# Altium schematic sheet Schematic.SchDoc
size A4; SheetNumber: 1; SheetTotal: 1
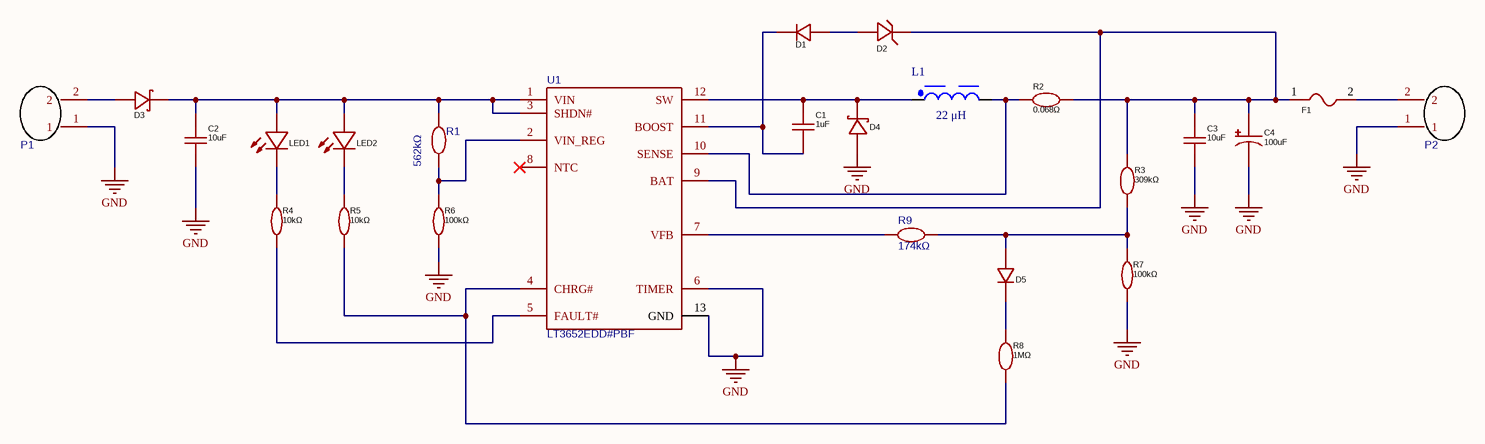
[diagram p0: Schematic.SchDoc]

## Parts
C1  1uF  [C0805]
C2  10uF  [C1206]
C3  10uF  [C1206]
C4  100uF  [CAP-SMD_BD8.0-L8.3-W8.3-LS9.5-FD]
D1  1N4148WS-7-F  [SOD-323_L1.8-W1.3-LS2.5-RD]  (value not drawn)
D2  MMSZ5234BT1G  [SOD-123_L2.8-W1.8-LS3.7-RD]  (value not drawn)
D3  V8PAL45-M3/I  [DO-221BC_L4.3-W2.7-LS5.3-RD]  (value not drawn)
D4  V8PAL45-M3/I  [DO-221BC_L4.3-W2.7-LS5.3-RD]  (value not drawn)
D5  1N4148WS-7-F  [SOD-323_L1.8-W1.3-LS2.5-RD]  (value not drawn)
F1  0437003.WR  [F1206]  (value not drawn)
L1  22 μH  [WE-PD_7345R]
LED1  LTST-C170KRKT  [LED0805-R-RD]  (value not drawn)
LED2  LTST-C170KRKT  [LED0805-R-RD]  (value not drawn)
P1  WJ128V-5.0-2P  [CONN-TH_2P-P5.00_WJ128V-5.0-2P]  (value not drawn)
P2  WJ128V-5.0-2P  [CONN-TH_2P-P5.00_WJ128V-5.0-2P]  (value not drawn)
R1  562kΩ  [R0805]
R2  0.068Ω  [R0805]
R3  309kΩ  [R0805]
R4  10kΩ  [R0805]
R5  10kΩ  [R0805]
R6  100kΩ  [R0805]
R7  100kΩ  [R0805]
R8  1MΩ  [R0805]
R9  174kΩ  [R0805]
U1  LT3652EDD#PBF  [DFN-12_L3.0-W3.0-P0.50-LS3.0-BL-EP]

## Nets
GND: C2.2 C3.1 C4.2 D4.2(K) P1.1 P2.1 R6.1 R7.1 U1.6(TIMER) U1.13(GND)
NetC1_1: C1.1 D1.1(C) U1.11(BOOST)
NetC1_2: C1.2 D4.1(A) L1.1 U1.12(SW)
NetC2_1: C2.1 D3.1(A) LED1.1(+) LED2.1(+) R1.2 U1.1(VIN) U1.3(SHDN#)
NetC3_2: C3.2 C4.1 D2.1(C) F1.1 R2.2 R3.2 U1.9(BAT)
NetD1_2: D1.2(A) D2.2(A)
NetD3_2: D3.2(K) P1.2
NetD5_1: D5.1(C) R8.2
NetD5_2: D5.2(A) R3.1 R7.2 R9.2
NetF1_2: F1.2 P2.2
NetL1_2: L1.2 R2.1 U1.10(SENSE)
NetLED1_2: LED1.2(-) R4.2
NetLED2_2: LED2.2(-) R5.2
NetR1_1: R1.1 R6.2 U1.2(VIN_REG)
NetR4_1: R4.1 U1.5(FAULT#)
NetR5_1: R5.1 R8.1 U1.4(CHRG#)
NetR9_1: R9.1 U1.7(VFB)

Not connected (* = marked no-connect by the designer): U1 8(NTC)*

## Notes on the sheet
- Date:
- Rev. No.
- Page No.
- Schematic Name
- Designed By
- Omar Faruk Badhon
- Check(1) HW Eng.
- Check(2) SW Eng.
- Approval(1)
- Approval(2)
- Address
- Company
- Dept. Name
- R&D

## Library data of the parts
C1 = GRM216R61E105KA12D: 25V 1uF X5R ±10% 0805 Multilayer Ceramic Capacitors MLCC - SMD/SMT ROHS; Manufacturer: muRata(村田); Add into BOM: yes; Symbol: GRM216R61E105KA12D; Device: GRM216R61E105KA12D; LCSC Part Name: 1uF ±10% 25V; Supplier Part: C440193; Manufacturer Part: GRM216R61E105KA12D; Supplier Footprint: 0805; JLCPCB Part Class: Extended Part; Datasheet: https://atta.szlcsc.com/upload/public/pdf/source/20191022/C440211_D691AF4420B7318595498C3E4B7F2331.pdf; Supplier: LCSC; Convert to PCB: yes; Value: 1uF; Tolerance: ±10%
C2 C3 = GRT31CR6YA106KE01L: 35V 10uF X5R ±10% 1206 Multilayer Ceramic Capacitors MLCC - SMD/SMT ROHS; Manufacturer: Murata Electronics; Add into BOM: yes; Symbol: GRT31CR6YA106KE01L; Device: GRT31CR6YA106KE01L; LCSC Part Name: 10uF ±10% 35V; Supplier Part: C2175512; Manufacturer Part: GRT31CR6YA106KE01L; Supplier Footprint: 1206; JLCPCB Part Class: Extended Part; Supplier: LCSC; Convert to PCB: yes; Value: 10uF; Tolerance: ±10%
C4 = EEEHC1E101P: 100uF 25V 130mA@120Hz ±20% SMD,D8xL10.2mm Aluminum Electrolytic Capacitors - SMD ROHS; Manufacturer: PANASONIC(松下); Add into BOM: yes; Lifetime @ Temp: 5000hrs@105℃; Symbol: EEEHC1E101P; Device: EEEHC1E101P; LCSC Part Name: 100uF ±20% 25V; Supplier Part: C336335; Manufacturer Part: EEEHC1E101P; Supplier Footprint: SMD,D8xL10.2mm; JLCPCB Part Class: Extended Part; Datasheet: https://atta.szlcsc.com/upload/public/pdf/source/20190305/C336336_78C21C8ECF10E68AF1E1A1FAA303815A.pdf; Supplier: LCSC; Convert to PCB: yes; Value: 100uF; Tolerance: ±20%; Ripple Current: 130mA@120Hz; Equivalent Series Resistance(ESR): -; Operating Temperature: -40℃~+105℃
D1 D5 = 1N4148WS-7-F: 75V Independent Type 1.25V@150mA 4ns 150mA SOD-323 Switching Diodes ROHS; Manufacturer: DIODES(美台); Add into BOM: yes; Reverse Leakage Current: 1uA@75V; Symbol: 1N4148WS-7-F; Device: 1N4148WS-7-F; LCSC Part Name: 电压:75V 电流:150mA; Supplier Part: C60580; Manufacturer Part: 1N4148WS-7-F; Supplier Footprint: SOD-323; JLCPCB Part Class: Extended Part; Datasheet: https://atta.szlcsc.com/upload/public/pdf/source/20160107/1457707747110.pdf; Supplier: LCSC; Convert to PCB: yes; Diode Configuration: Independent Type; Forward Voltage (Vf@If): 1.25V@150mA; Operating Temperature: -65℃~+150℃@(Tj)
D2 = MMSZ5234BT1G: Independent Type 5.89V~6.51V 500mW 6.2V SOD-123 Zener Diodes ROHS; Manufacturer: onsemi(安森美); Add into BOM: yes; Reverse Leakage Current (Ir): 5uA@4V; Impedance(Zzt): 7Ω; Symbol: MMSZ5234BT1G; Device: MMSZ5234BT1G; LCSC Part Name: MMSZ5234BT1G; Supplier Part: C194181; Manufacturer Part: MMSZ5234BT1G; Supplier Footprint: SOD-123; JLCPCB Part Class: Extended Part; Datasheet: https://atta.szlcsc.com/upload/public/pdf/source/20221020/24E30AC3B161AD81AE78606E4A7F6AC2.pdf; Supplier: LCSC; Convert to PCB: yes; Diode Configuration: Independent Type; Zener Voltage(Nom): 6.2V; Zener Voltage(Range): 5.89V~6.51V; Pd - Power Dissipation(Pd): 500mW
D3 D4 = V8PAL45-M3/I: 45V 4A 570mV@8A DO-221BC(SMPA) Schottky Diodes ROHS; Manufacturer: VISHAY(威世); Add into BOM: yes; Reverse Leakage Current (Ir): 1.85mA@45V; Symbol: V8PAL45-M3/I; Device: V8PAL45-M3/I; LCSC Part Name: 电压:45V 电流:4A; Supplier Part: C3759194; Manufacturer Part: V8PAL45-M3/I; Supplier Footprint: DO-221BC(SMPA); JLCPCB Part Class: Extended Part; Datasheet: https://atta.szlcsc.com/upload/public/pdf/source/20231212/E8913B3A928D0C347C4F04EA6F9113F3.pdf; Supplier: LCSC; Convert to PCB: yes; Forward Voltage (Vf@If): 570mV@8A; Reverse Voltage (Vr): 45V; Rectified Current: 4A
F1 = Fuse: 50A SMD Fuse 3A 32V 1206 Disposable fuses ROHS; Manufacturer: Littelfuse(美国力特); Add into BOM: yes; Voltage Rating (DC): 35V; Symbol: 0437003.WR; Device: 0437003.WR; LCSC Part Name: 32V贴片式保险丝; Supplier Part: C99539; Manufacturer Part: 0437003.WR; Supplier Footprint: 1206; JLCPCB Part Class: Extended Part; Datasheet: https://atta.szlcsc.com/upload/public/pdf/source/20170322/1490151740362.pdf; Supplier: LCSC; Convert to PCB: yes; Type: SMD Fuse; Current Rating: 3A; Voltage Rating  (AC): 32V; Operating Temperature: -55℃~+150℃; Breaking Capacity: 50A
L1 = 7447779122: WE-PD SMT Power Inductor, size 7345R, 22 μH, 1.41 A, 110 mΩ; Manufacturer: Wurth Elektronik; DC Resistance: 90 mΩ; DC Resistance Max: 110 mΩ; Rated Current: 1.41 A; Saturation Current: 1.7 A; Self Resonant Frequency: 17 MHz; Type: Robust; Manufacturer Part Number: 7447779122; Category: Power Inductors; Match Code: WE-PD; ComponentLink1Description: Website Link; ComponentLink1URL: https://www.we-online.com/redexpert/article/7447779122?ad; ComponentLink2Description: Datasheet Link; ComponentLink2URL: https://www.we-online.com/redexpert/spec/7447779122?ad; Mount: Surface Mount; Min Operating Temperature: -40 °C; Max Operating Temperature: 125 °C; Packaging: Tape and Reel; Case/Size Code: 7345R; Length: 7.3 mm; Width: 7.3 mm; Height: 4.5 mm; Inductance: 22 μH
LED1 LED2 = LTST-C170KRKT: 20mA 54mcd Colorless Transparent Lens -55℃~+85℃ 631nm Red 130° 75mW 2V 0805 LED Indication - Discrete ROHS; Manufacturer: LITEON(光宝); Add into BOM: yes; Peak Wavelength: 639nm; Symbol: LTST-C170KRKT; Device: LTST-C170KRKT; LCSC Part Name: LTST-C170KRKT; Supplier Part: C94868; Manufacturer Part: LTST-C170KRKT; Supplier Footprint: 0805; JLCPCB Part Class: Extended Part; Datasheet: https://atta.szlcsc.com/upload/public/pdf/source/20170325/1490427902593.pdf; Supplier: LCSC; Convert to PCB: yes; Emitted Color: Red; Forward Voltage (VF): 2V; Power Dissipation: 75mW; Forward Current: 20mA; Dominant Wavelength: 631nm; Diode Configuration: -; Lens Color: Colorless Transparent Lens; Color Temperature: -; Luminous Intensity: 54mcd; Viewing Angle: 130°; Mounting Sytle: -; Operating Temperature: -55℃~+85℃
P1 P2 = WJ128V-5.0-2P: 1x2P 20A -40℃~+105℃ 250V Green 12~22 Direct Insert 5mm 2.5 1 2 Plugin,P=5mm Screw Terminal Blocks ROHS; Manufacturer: KANGNEX(康奈克斯电气); Supplier: LCSC; Manufacturer Part: WJ128V-5.0-2P; Supplier Part: C8269; JLCPCB Part Class: Extended Part; spicePre: P; spiceSymbolName: WJ128V-5.0-2P
R1 = ERJ6ENF5623V: 0.125W Thick Film Resistors ±100ppm/℃ ±1% 562kΩ 0805 Chip Resistor - Surface Mount ROHS; Manufacturer: PANASONIC(松下); nameAlias: Value; Contributor: LCSC; Supplier: LCSC; Supplier Part: C3025620; Manufacturer Part: ERJ6ENF5623V; JLCPCB Part Class: Extended Part; spicePre: R; spiceSymbolName: ERJ6ENF5623V
R2 = FRL0805JR068TS: 0.125W Thick Film Resistors 300V ±600ppm/℃ ±5% 0.068Ω 0805 Chip Resistor - Surface Mount ROHS; Manufacturer: FOJAN; Add into BOM: yes; Value: 0.68Ω; Tolerance: ±1%; Temperature Coefficient: ±200ppm/℃; Symbol: FRL0805JR068TS; Device: FRL0805JR068TS; LCSC Part Name: C3000696; Supplier Part: C3000696; Manufacturer Part: FRL0805JR068TS; Supplier Footprint: 0805; JLCPCB Part Class: Extended Part; Supplier: LCSC; Convert to PCB: yes; Type: Thick Film Resistors; Overload Voltage (Max): -; Operating Temperature Range: -55℃~+155℃
R3 = ERJ6ENF3093V: 309kΩ 0805 Chip Resistor 0.125W Thick Film Resistors ±100ppm/℃ ±1%  - Surface Mount ROHS; Manufacturer: PANASONIC(松下); Add into BOM: yes; Symbol: ERJ6ENF3093V; Device: ERJ6ENF3093V; LCSC Part Name: 309kΩ ±1% 125mW 厚膜电阻; Supplier Part: C410005; Manufacturer Part: ERJ6ENF3093V; Supplier Footprint: 0805; JLCPCB Part Class: Extended Part; Datasheet: https://atta.szlcsc.com/upload/public/pdf/source/20190806/C410005_411FBB62F8BDC8BC9CE172F2BD7302D6.pdf; Supplier: LCSC; Convert to PCB: yes; Type: Thick Film Resistors; Value: 309kΩ; Tolerance: ±1%; Overload Voltage (Max): -; Temperature Coefficient: ±100ppm/℃; Operating Temperature Range: -55℃~+155℃
R4 R5 = ERJPB6B1002V: 10kΩ 0805 Chip Resistor  0.2W Thick Film Resistors 200V ±50ppm/℃ ±0.1% - Surface Mount ROHS; Manufacturer: PANASONIC(松下); Add into BOM: yes; Symbol: ERJPB6B1002V; Device: ERJPB6B1002V; LCSC Part Name: 10kΩ ±0.1% 200mW 厚膜电阻; Supplier Part: C161788; Manufacturer Part: ERJPB6B1002V; Supplier Footprint: 0805; JLCPCB Part Class: Extended Part; Datasheet: https://atta.szlcsc.com/upload/public/pdf/source/20180416/C191317_151B7FE0B8A326015C369A5828110A93.pdf; Supplier: LCSC; Convert to PCB: yes; Type: Thick Film Resistors; Value: 10kΩ; Tolerance: ±0.1%; Temperature Coefficient: ±50ppm/℃; Operating Temperature Range: -55℃~+155℃
R6 R7 = ERJ6ENF1003V: 100kΩ 0805 Chip Resistor 0.125W Thick Film Resistors ±100ppm/℃ ±1%  - Surface Mount ROHS; Manufacturer: PANASONIC(松下); Add into BOM: yes; Symbol: ERJ6ENF1003V; Device: ERJ6ENF1003V; LCSC Part Name: 100kΩ ±1% 125mW 厚膜电阻; Supplier Part: C169252; Manufacturer Part: ERJ6ENF1003V; Supplier Footprint: 0805; JLCPCB Part Class: Extended Part; Datasheet: https://atta.szlcsc.com/upload/public/pdf/source/20181222/C169252_7F18A762E4E3D9CA9CBEEE198C53D3F1.pdf; Supplier: LCSC; Convert to PCB: yes; Type: Thick Film Resistors; Value: 100kΩ; Tolerance: ±1%; Overload Voltage (Max): -; Temperature Coefficient: ±100ppm/℃; Operating Temperature Range: -55℃~+155℃
R8 = ERJP06J105V: 1MΩ 0805 Chip Resistor  0.5W Thick Film Resistors ±5% ±200ppm/℃ - Surface Mount ROHS; Manufacturer: PANASONIC(松下); Add into BOM: yes; Symbol: ERJP06J105V; Device: ERJP06J105V; LCSC Part Name: 1MΩ ±5% 500mW 厚膜电阻; Supplier Part: C441966; Manufacturer Part: ERJP06J105V; Supplier Footprint: 0805; JLCPCB Part Class: Extended Part; Supplier: LCSC; Convert to PCB: yes; Type: Thick Film Resistors; Value: 1MΩ; Tolerance: ±5%; Overload Voltage (Max): -; Temperature Coefficient: ±200ppm/℃; Operating Temperature Range: -55℃~+155℃
R9 = ERJ6ENF1743V: 174kΩ 0805 Chip Resistor  0.125W Thick Film Resistors ±100ppm/℃ ±1% - Surface Mount ROHS; Manufacturer: PANASONIC(松下); nameAlias: Value; Contributor: LCSC; Supplier: LCSC; Supplier Part: C409978; Manufacturer Part: ERJ6ENF1743V; JLCPCB Part Class: Extended Part; spicePre: R; spiceSymbolName: ERJ6ENF1743V
U1 = LT3652EDD#PBF: 4.95V~32V Multi-Chemical 1~4 2A DFN-12(3x3) Battery Management ROHS; Manufacturer: ADI(亚德诺); Supplier: LCSC; Manufacturer Part: LT3652EDD#PBF; Supplier Part: C96510; JLCPCB Part Class: Extended Part; spicePre: U; spiceSymbolName: LT3652EDD#PBF